# Altium schematic sheet Pocket_musical_instrument V18_2021-09-19.schdoc
size 990 x 389 mm
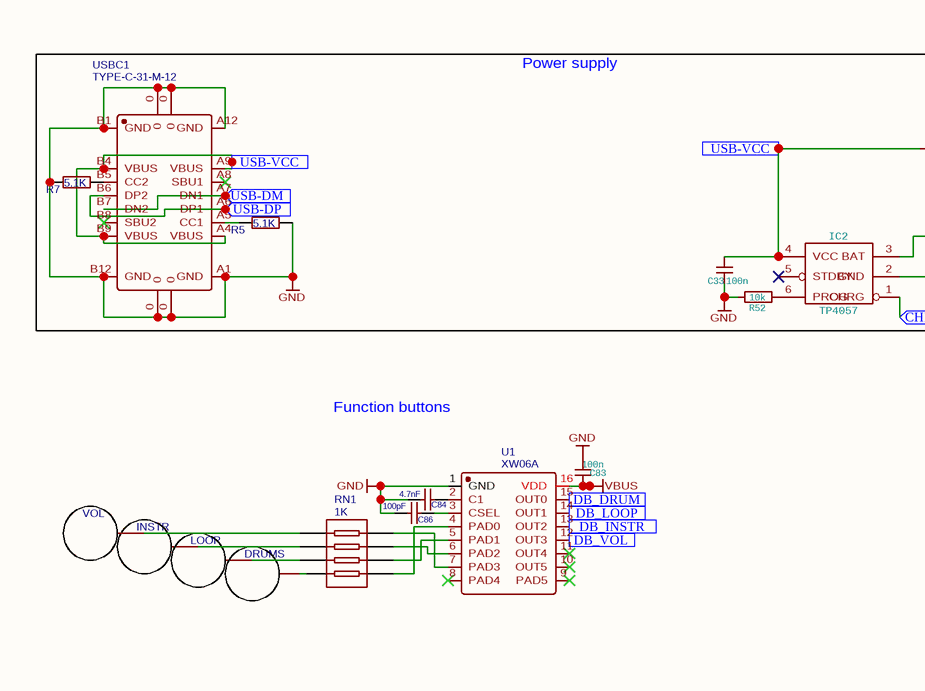
[diagram p0: Pocket_musical_instrument V18_2021-09-19.schdoc, top left]
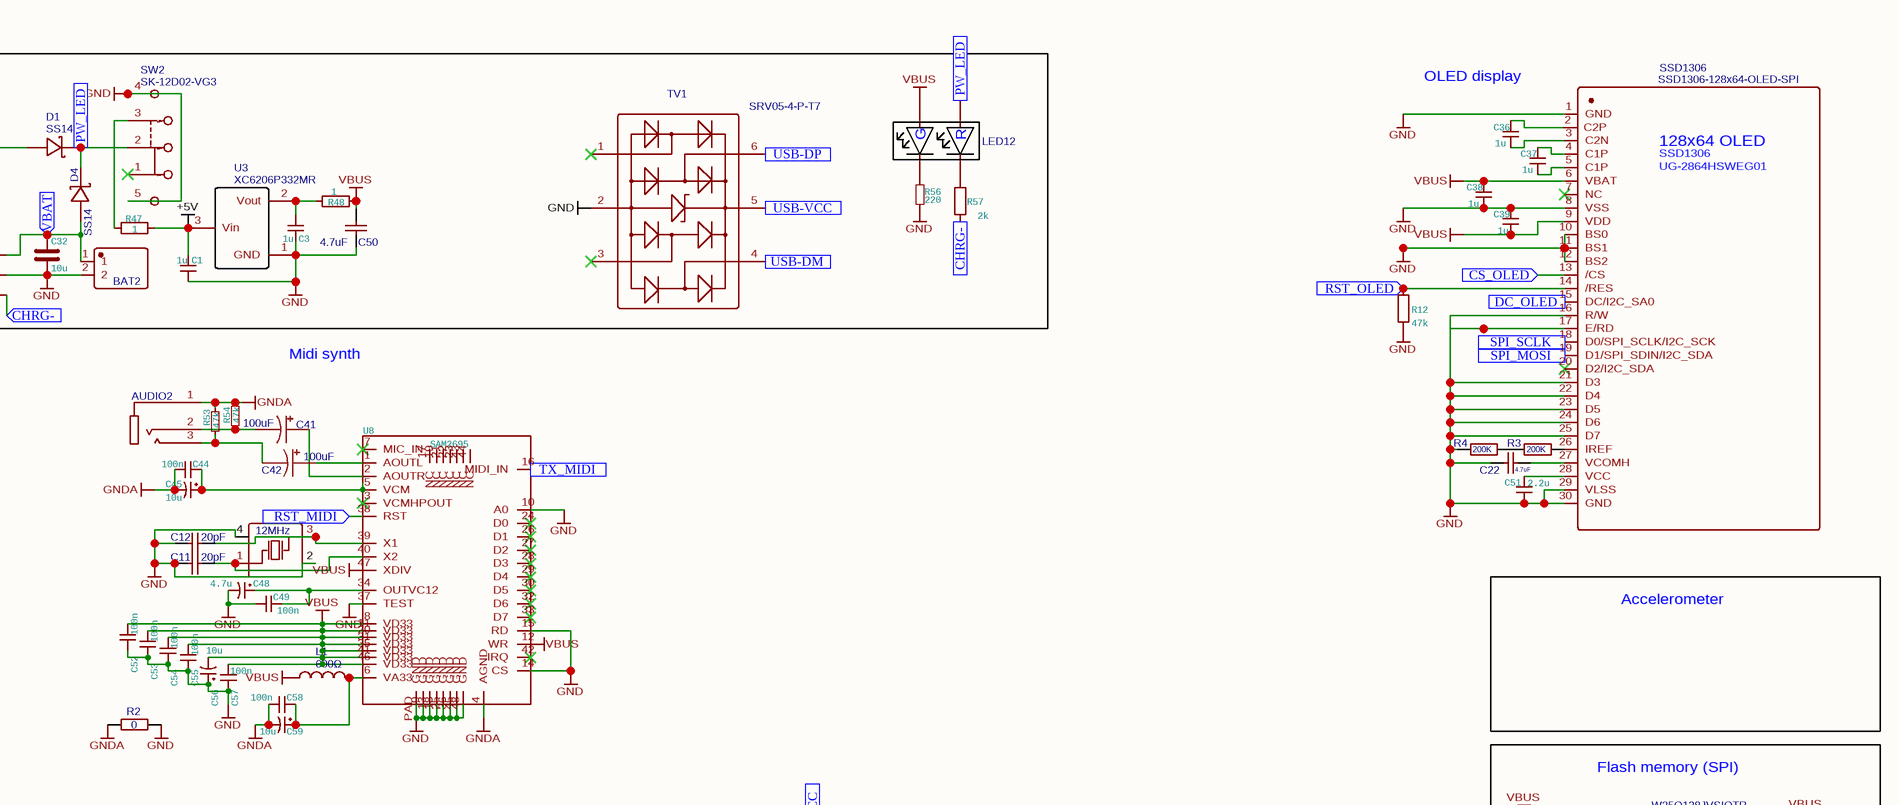
[diagram p1: Pocket_musical_instrument V18_2021-09-19.schdoc, top middle]
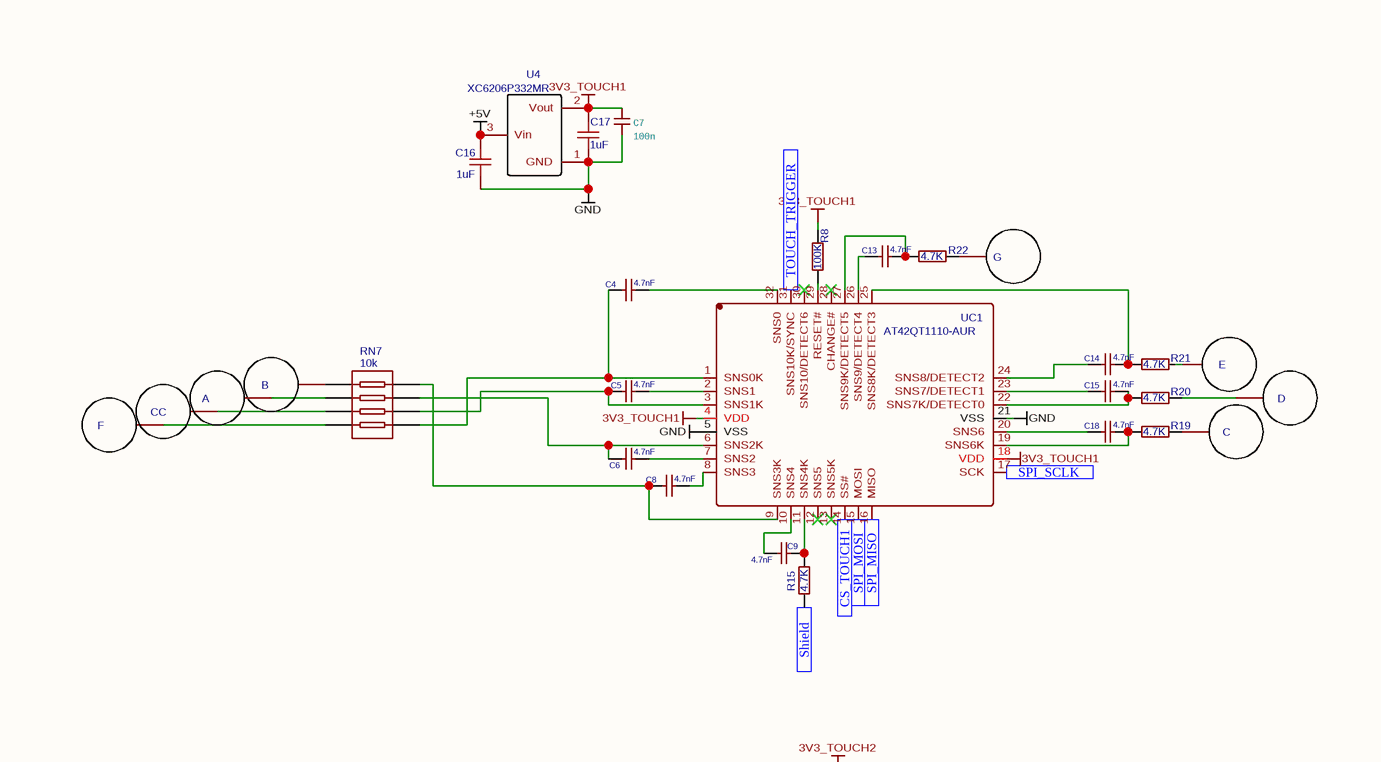
[diagram p2: Pocket_musical_instrument V18_2021-09-19.schdoc, top right]
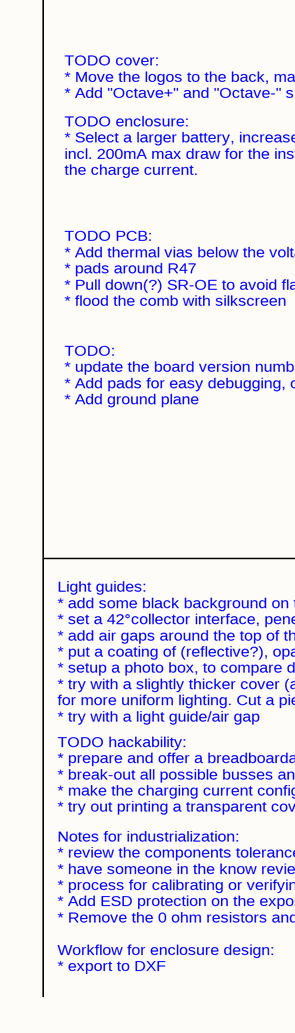
[diagram p3: Pocket_musical_instrument V18_2021-09-19.schdoc, bottom left]
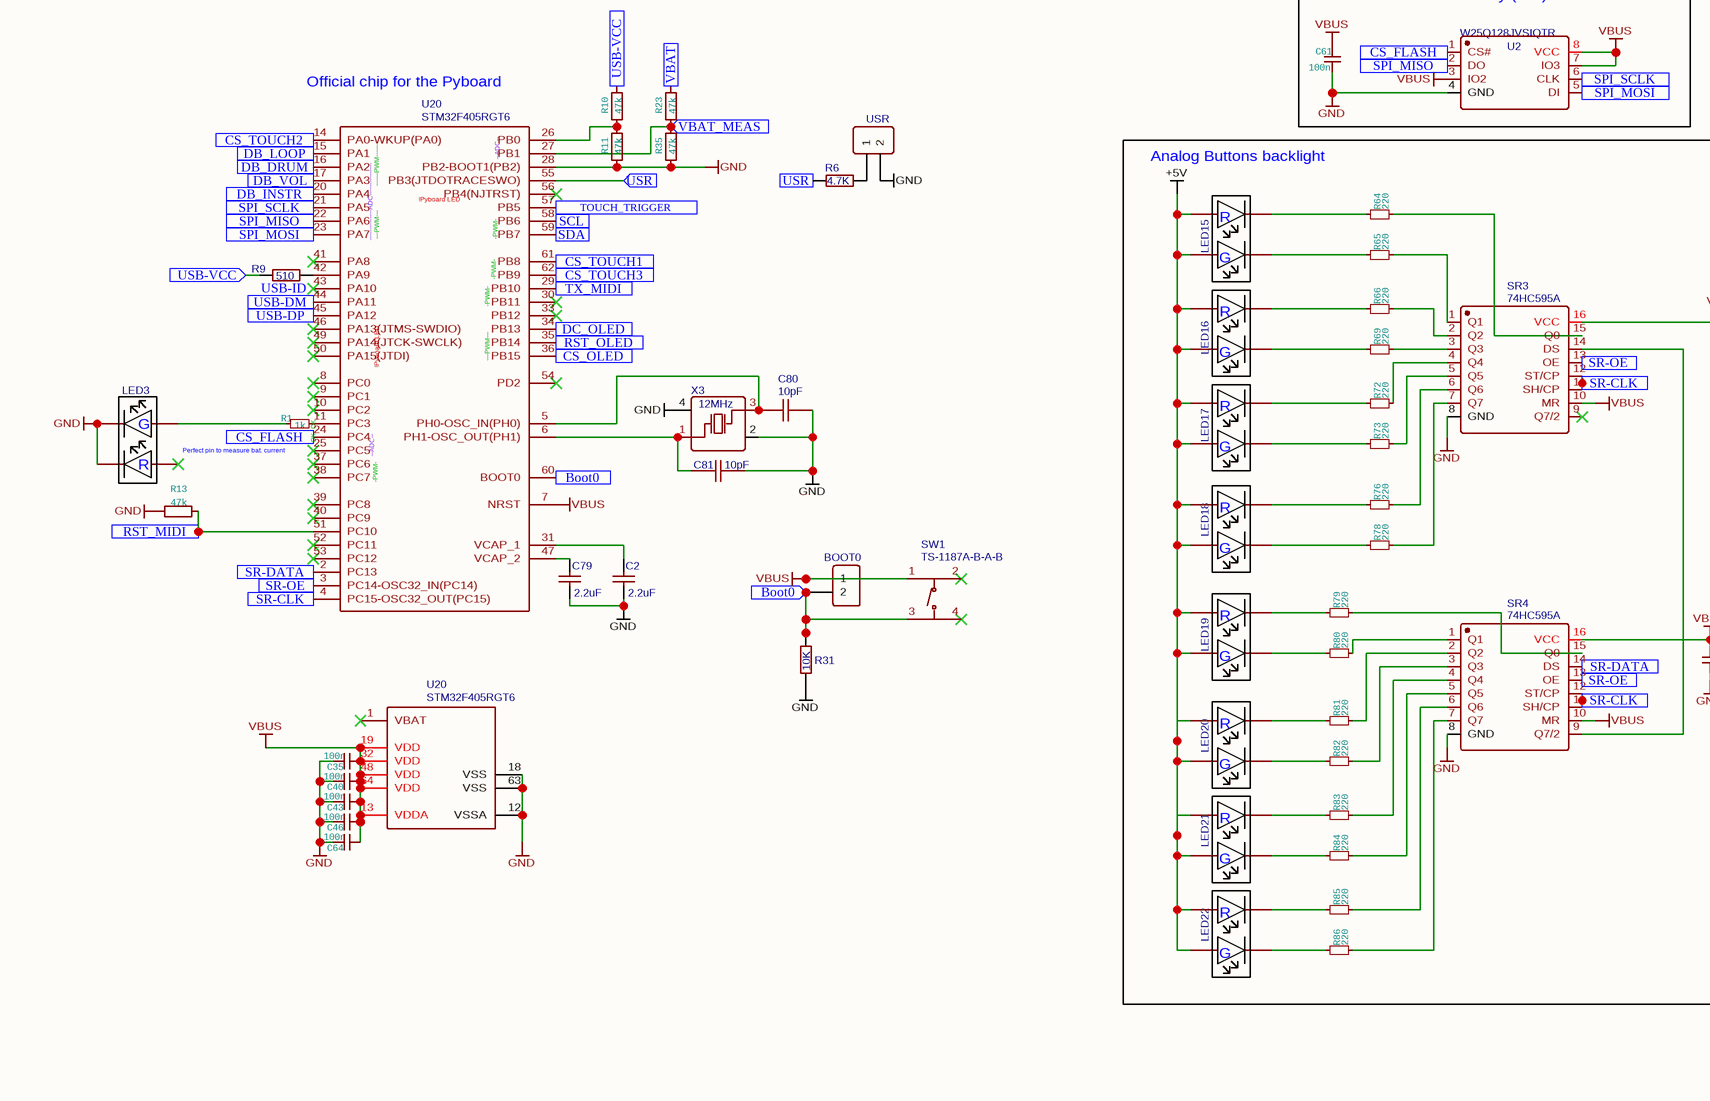
[diagram p4: Pocket_musical_instrument V18_2021-09-19.schdoc, bottom middle]
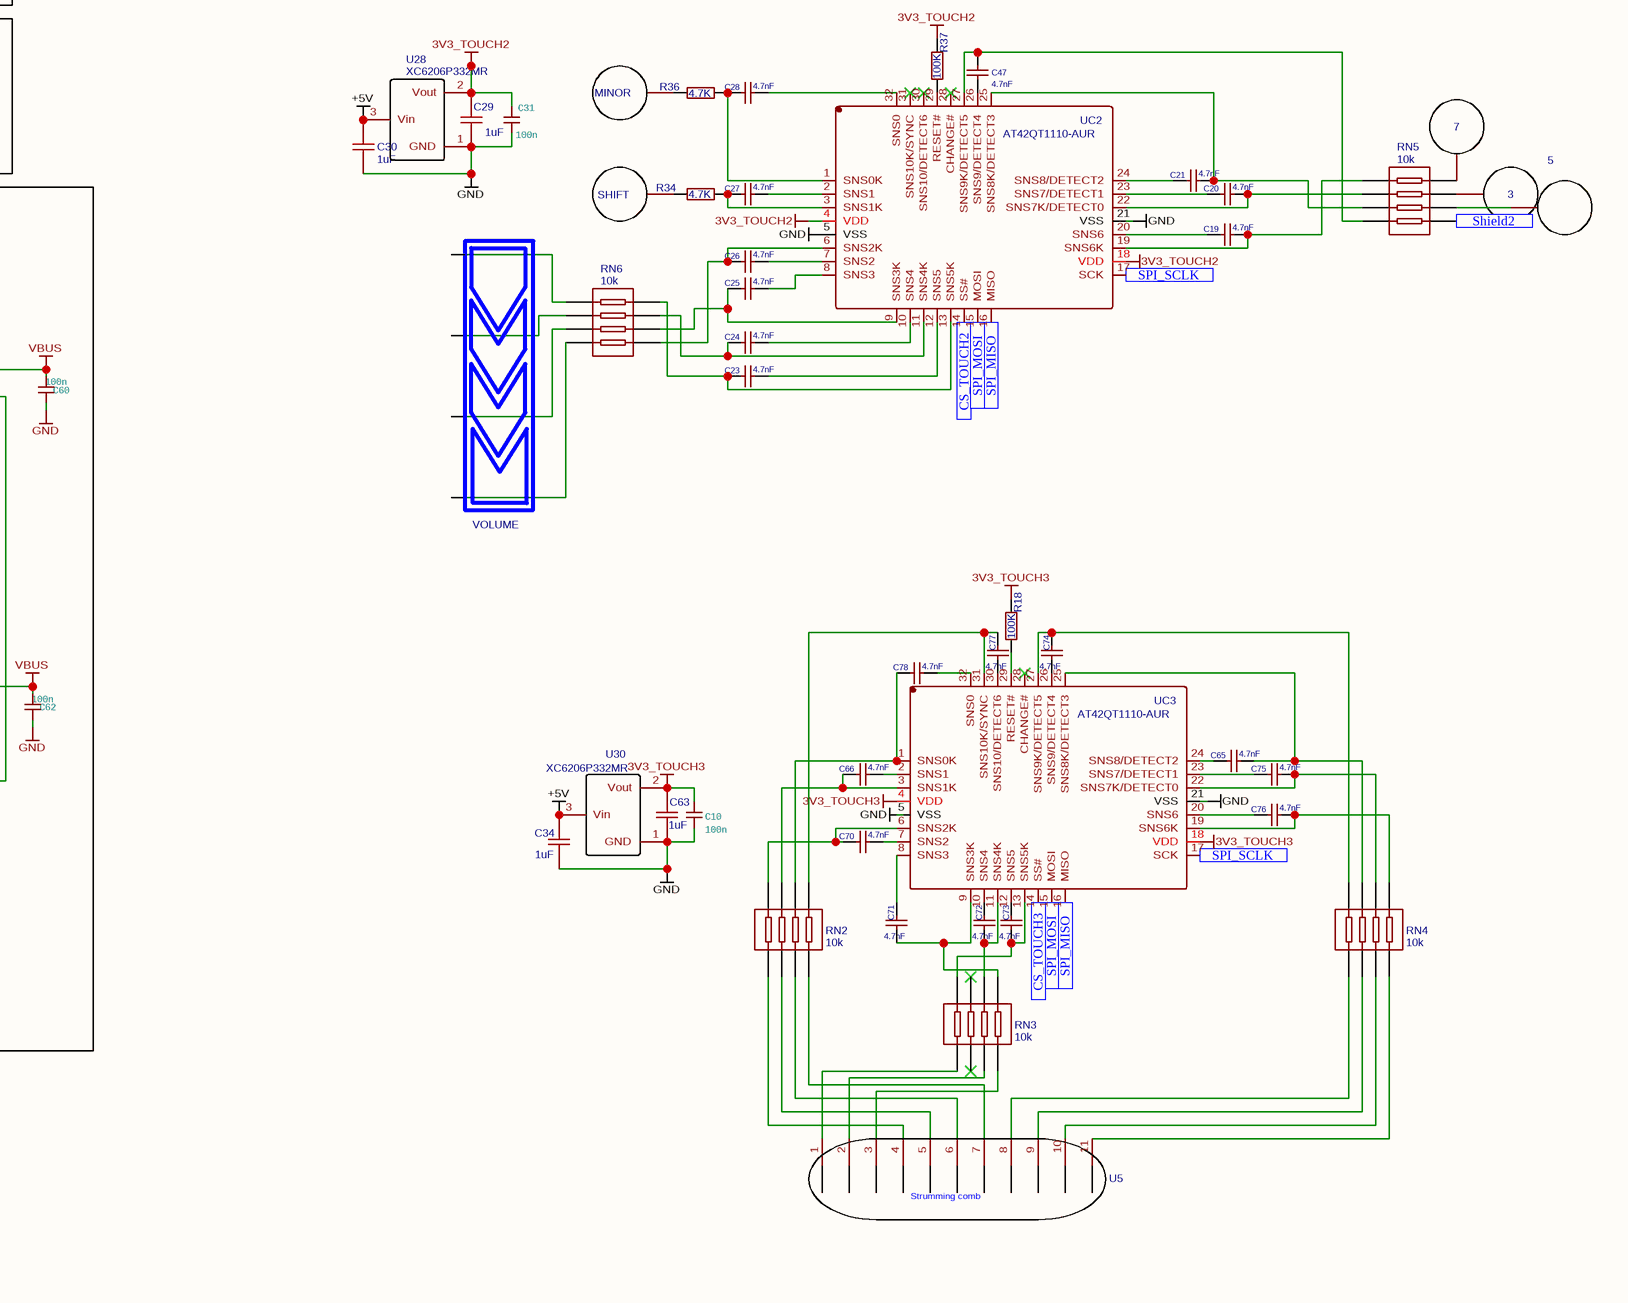
[diagram p5: Pocket_musical_instrument V18_2021-09-19.schdoc, bottom right]

## Parts
(Parts that share a designator on the sheet are numbered #1, #2 ... from top to bottom, then left to right.)
3  CAPACITIVE_PAD  [CAPACITIVE_PAD_ROUND]  (value not drawn)
5  CAPACITIVE_PAD  [CAPACITIVE_PAD_ROUND]  (value not drawn)
7  CAPACITIVE_PAD  [CAPACITIVE_PAD_ROUND]  (value not drawn)
A  CAPACITIVE_PAD  [PAD_11MM_CUT-OFF]  (value not drawn)
AUDIO2  PJ-313D_C319112  [PHONE-JACK-5P-6.0X12.5-H5.0]  (value not drawn)
B  CAPACITIVE_PAD  [PAD_11MM_CUT-OFF]  (value not drawn)
BAT2  A2001WR-S-2P  [A2001WR-S-2P]  (value not drawn)
C  CAPACITIVE_PAD  [PAD_11MM_CUT-OFF]  (value not drawn)
C1  1u  [0402]
C2  2.2uF  [C0603]
C3  1u  [0402]
C4  4.7nF  [C0402]
C5  4.7nF  [C0402]
C6  4.7nF  [C0402]
C7  100n  [0402]
C8  4.7nF  [C0402]
C9  4.7nF  [C0402]
C10  100n  [0402]
C11  20pF  [C0402]
C12  20pF  [C0402]
C13  4.7nF  [C0402]
C14  4.7nF  [C0402]
C15  4.7nF  [C0402]
C16  1uF  [C0402]
C17  1uF  [C0402]
C18  4.7nF  [C0402]
C19  4.7nF  [C0402]
C20  4.7nF  [C0402]
C21  4.7nF  [C0402]
C22  4.7uF  [C0402]
C23  4.7nF  [C0402]
C24  4.7nF  [C0402]
C25  4.7nF  [C0402]
C26  4.7nF  [C0402]
C27  4.7nF  [C0402]
C28  4.7nF  [C0402]
C29  1uF  [C0402]
C30  1uF  [C0402]
C31  100n  [0402]
C32  10u  [0402]
C33  100n  [0402]
C34  1uF  [C0402]
C35  100n  [0402]
C36  1u  [0402]
C37  1u  [0402]
C38  1u  [0402]
C39  1u  [0402]
C40  100n  [0402]
C41  100uF  [CAP_5X5.4]
C42  100uF  [CAP_5X5.4]
C43  100n  [0402]
C44  100n  [0402]
C45  10u  [0402]
C46  100n  [0402]
C47  4.7nF  [C0402]
C48  4.7u  [0402]
C49  100n  [0402]
C50  4.7uF  [C0402]
C51  2.2u  [0603]
C52  100n  [0402]
C53  100n  [0402]
C54  100n  [0402]
C55  100n  [0402]
C56  10u  [0402]
C57  100n  [0402]
C58  100n  [0402]
C59  10u  [0402]
C60  100n  [0402]
C61  100n  [0402]
C62  100n  [0402]
C63  1uF  [C0402]
C64  100n  [0402]
C65  4.7nF  [C0402]
C66  4.7nF  [C0402]
C70  4.7nF  [C0402]
C71  4.7nF  [C0402]
C72  4.7nF  [C0402]
C73  4.7nF  [C0402]
C74  4.7nF  [C0402]
C75  4.7nF  [C0402]
C76  4.7nF  [C0402]
C77  4.7nF  [C0402]
C78  4.7nF  [C0402]
C79  2.2uF  [C0603]
C80  10pF  [C0402]
C81  10pF  [C0402]
C83  100n  [0402]
C84  4.7nF  [C0402]
C86  100pF  [C0402]
CC  CAPACITIVE_PAD  [PAD_11MM_CUT-OFF]  (value not drawn)
D  CAPACITIVE_PAD  [PAD_11MM_CUT-OFF]  (value not drawn)
D1  SS14  [SMA_L4.3-W2.6-LS5.2-FD]
D4  SS14  [SMA_L4.3-W2.6-LS5.2-FD]
DRUMS  CAPACITIVE_PAD  [T1147-1_PIN]  (value not drawn)
E  CAPACITIVE_PAD  [PAD_11MM_CUT-OFF]  (value not drawn)
F  CAPACITIVE_PAD  [PAD_11MM_CUT-OFF]  (value not drawn)
G  CAPACITIVE_PAD  [PAD_11MM_CUT-OFF]  (value not drawn)
IC2  TP4057  [SOT-23-6]
INSTR  CAPACITIVE_PAD  [T1147-1_PIN]  (value not drawn)
L1  600Ω  [L0805]
LED3  SHIFT  [LED-SMD_4PIN-L3.2-W1.25-H1.1-TR-TEMPE]  (value not drawn)
LED12  PW/CHRG  [LED-SMD_4PIN-L3.2-W1.25-H1.1-TR-TEMPE]  (value not drawn)
LED15  Reverse bicolor LED  [LED-SMD_4PIN-L3.2-W1.25-H1.1-TR-TEMPE]  (value not drawn)
LED16  Reverse bicolor LED  [LED-SMD_4PIN-L3.2-W1.25-H1.1-TR-TEMPE]  (value not drawn)
LED17  Reverse bicolor LED  [LED-SMD_4PIN-L3.2-W1.25-H1.1-TR-TEMPE]  (value not drawn)
LED18  Reverse bicolor LED  [LED-SMD_4PIN-L3.2-W1.25-H1.1-TR-TEMPE]  (value not drawn)
LED19  Reverse bicolor LED  [LED-SMD_4PIN-L3.2-W1.25-H1.1-TR-TEMPE]  (value not drawn)
LED20  Reverse bicolor LED  [LED-SMD_4PIN-L3.2-W1.25-H1.1-TR-TEMPE]  (value not drawn)
LED21  Reverse bicolor LED  [LED-SMD_4PIN-L3.2-W1.25-H1.1-TR-TEMPE]  (value not drawn)
LED22  Reverse bicolor LED  [LED-SMD_4PIN-L3.2-W1.25-H1.1-TR-TEMPE]  (value not drawn)
LOOP  CAPACITIVE_PAD  [T1147-1_PIN]  (value not drawn)
MINOR  CAPACITIVE_PAD  [CAPACITIVE_PAD_OVAL_22_8]  (value not drawn)
P1  BOOT0  [JUMPER]
P3  USR  [JUMPER]
R1  1k  [0402]
R2  0  [R0402]
R3  200K  [R0402]
R4  200K  [R0402]
R5  5.1K  [R0402]
R6  4.7K  [R0402]
R7  5.1K  [R0402]
R8  100K  [R0402]
R9  510  [R0402]
R10  47k  [0402]
R11  47k  [0402]
R12  47k  [0402]
R13  47k  [0402]
R15  4.7K  [R0402]
R18  100K  [R0402]
R19  4.7K  [R0402]
R20  4.7K  [R0402]
R21  4.7K  [R0402]
R22  4.7K  [R0402]
R23  47k  [0402]
R31  10K  [R0402]
R34  4.7K  [R0402]
R35  47k  [0402]
R36  4.7K  [R0402]
R37  100K  [R0402]
R47  1  [0402]
R48  1  [0402]
R52  10k  [0402]
R53  47k  [0402]
R54  47k  [0402]
R56  220  [0402]
R57  2k  [0402]
R64  220  [0402]
R65  220  [0402]
R66  220  [0402]
R69  220  [0402]
R72  220  [0402]
R73  220  [0402]
R76  220  [0402]
R78  220  [0402]
R79  220  [0402]
R80  220  [0402]
R81  220  [0402]
R82  220  [0402]
R83  220  [0402]
R84  220  [0402]
R85  220  [0402]
R86  220  [0402]
RN1  1K  [RES-ARRAY-SMD_0402-8P-L2.0-W1.0-BL]
RN2  10k  [RES-ARRAY-SMD_0402-8P-L2.0-W1.0-BL]
RN3  10k  [RES-ARRAY-SMD_0402-8P-L2.0-W1.0-BL]
RN4  10k  [RES-ARRAY-SMD_0402-8P-L2.0-W1.0-BL]
RN5  10k  [RES-ARRAY-SMD_0402-8P-L2.0-W1.0-BL]
RN6  10k  [RES-ARRAY-SMD_0402-8P-L2.0-W1.0-BL]
RN7  10k  [RES-ARRAY-SMD_0402-8P-L2.0-W1.0-BL]
SHIFT  CAPACITIVE_PAD  [CAPACITIVE_PAD_ROUND]  (value not drawn)
SR3  74HC595A  [SOIC-16_150MIL]
SR4  74HC595A  [SOIC-16_150MIL]
SSD1306  SSD1306-128x64-OLED-SPI  [SSD1306-30PIN-POT REVERSED]
SW1  TS-1187A-B-A-B  [SW-SMD_4P-L5.1-W5.1-P3.70-LS6.5-2]
SW2  SK-12D02-VG3  [SW-TH_SK-12D02VG3]
TV1  SRV05-4-P-T7  [SOT-23-6_L2.9-W1.6-P0.95-LS2.8-BR]
U1  XW06A  [SOP-16_L10.0-W3.9-P1.27-LS6.0-BL]
U2  W25Q128JVSIQTR  [SOIC-8_L5.3-W5.3-P1.27-LS8.0-BL]
U3  XC6206P332MR  [SOT-23-3_L2.9-W1.6-P1.90-LS2.8-BR]
U4  XC6206P332MR  [SOT-23-3_L2.9-W1.6-P1.90-LS2.8-BR]
U5  Strumming_comb_11  [STRUMMING_COMB_11]  (value not drawn)
U8  SAM2695  [QFN48G-0.4-6X6MM]
U20#1  STM32F405RGT6  [LQFP-64_L10.0-W10.0-P0.50-LS12.0-TL]
U20#2  STM32F405RGT6  [LQFP-64_L10.0-W10.0-P0.50-LS12.0-TL]
U28  XC6206P332MR  [SOT-23-3_L2.9-W1.6-P1.90-LS2.8-BR]
U30  XC6206P332MR  [SOT-23-3_L2.9-W1.6-P1.90-LS2.8-BR]
UC1  AT42QT1110-AUR  [TQFP-32_L7.0-W7.0-P0.80-LS9.0-BL]
UC2  AT42QT1110-AUR  [TQFP-32_L7.0-W7.0-P0.80-LS9.0-BL]
UC3  AT42QT1110-AUR  [TQFP-32_L7.0-W7.0-P0.80-LS9.0-BL]
USBC1  TYPE-C-31-M-12  [USB-C_SMD-TYPE-C-31-M-12]
VOL  CAPACITIVE_PAD  [T1147-1_PIN]  (value not drawn)
VOLUME  Slide Key 4 pads  [SLIDER_4]  (value not drawn)
X1  12MHz  [OSC-SMD_4P-L3.2-W2.5-BL]
X3  12MHz  [OSC-SMD_4P-L3.2-W2.5-BL]

## Blocks framed on the sheet
Power supply: BAT2 C1 C3 C32 C33 C50 D1 D4 IC2 LED12 R5 R7 R47 R48 R52 R56 R57 SW2 TV1 U3 USBC1
Flash memory (SPI): C61 U2
Analog Buttons backlight: C60 C62 LED15-LED22 R64-R66 R69 R72 R73 R76 R78-R86 SR3 SR4

## Ports
Boot0 (in), CHRG- (in), CS_FLASH (in), CS_OLED (in), CS_TOUCH1 (in), CS_TOUCH2 (in), CS_TOUCH3 (in), DB_DRUM (in), DB_INSTR (in), DB_LOOP (in), DB_VOL (in), DC_OLED (in), PW_LED (in), RST_MIDI (in), RST_OLED (in), SCL (in), SDA (in), Shield2 (in), Shield (in), SPI_MISO (in), SPI_MOSI (in), SPI_SCLK (in), SR-CLK (in), SR-DATA (in), SR-OE (in), TOUCH_TRIGGER (in), TX_MIDI (in), USB-DM (in), USB-DP (in), USB-VCC (in), USR (in), VBAT (in), VBAT_MEAS (in)

## Nets
3V3_TOUCH1: C7.1 C17.2 R8.2 U4.2(Vout) UC1.4(VDD) UC1.18(VDD)
3V3_TOUCH2: C29.2 C31.2 R37.2 U28.2(Vout) UC2.4(VDD) UC2.18(VDD)
3V3_TOUCH3: C10.1 C63.2 R18.2 U30.2(Vout) UC3.4(VDD) UC3.18(VDD)
+5V: C1.2 C16.2 C30.2 C34.2 LED15.1 LED15.3 LED16.1 LED16.3 LED17.1 LED17.3 LED18.1 LED18.3 LED19.1 LED19.3 LED20.1 LED20.3 LED21.1 LED21.3 LED22.1 LED22.3 R47.2 U3.3(Vin) U4.3(Vin) U28.3(Vin) U30.3(Vin)
GND: BAT2.2 C1.1 C2.2 C3.1 C7.2 C10.2 C11.1 C12.1 C16.1 C17.1 C22.1 C29.1 C30.1 C31.1 C32.2 C33.2 C34.1 C35.1 C38.2 C39.1 C40.1 C43.1 C46.1 C48.2 C49.2 C50.1 C51.2 C52.1 C53.1 C54.1 C55.1 C56.1 C57.1 C60.2 C61.1 C62.2 C63.1 C64.1 C79.1 C80.2 C81.1 C83.1 C84.1 C86.1 IC2.2(GND) LED3.2 LED3.4 P3.2 R2.1 R4.1 R5.2 R7.1 R11.1 R12.2 R13.1 R31.2 R35.1 R52.2 R56.2 SR3.8(GND) SR4.8(GND) SSD1306.1(GND) SSD1306.8(VSS) SSD1306.10(BS0) SSD1306.11(BS1) SSD1306.12(BS2) SSD1306.16(R/W) SSD1306.17(E/RD) SSD1306.21(D3) SSD1306.22(D4) SSD1306.23(D5) SSD1306.24(D6) SSD1306.25(D7) SSD1306.29(VLSS) SSD1306.30(GND) SW2.4 SW2.5 TV1.2 U1.1(GND) U2.4(GND) U3.1(GND) U4.1(GND) U8.9(GND) U8.10(A0) U8.13(GND) U8.14(CS) U8.15(RD) U8.18(GND) U8.25(GND) U8.36(GND) U8.37(TEST) U8.45(GND) U8.48(GND) U8.PAD(GND) U20#1.28(PB2-BOOT1(PB2)) U20#2.12(VSSA) U20#2.18(VSS) U20#2.63(VSS) U28.1(GND) U30.1(GND) UC1.5(VSS) UC1.21(VSS) UC2.5(VSS) UC2.21(VSS) UC3.5(VSS) UC3.21(VSS) USBC1.0 USBC1.A1(GND) USBC1.A12(GND) USBC1.B1(GND) USBC1.B12(GND) X1.2(GND) X1.4(GND) X3.2(GND) X3.4(GND)
GNDA: AUDIO2.1 C44.2 C45.2 C58.2 C59.2 R2.2 R53.1 R54.1 U8.4(AGND)
VBUS: C35.2 C38.1 C39.2 C40.2 C43.2 C46.2 C50.2 C52.2 C53.2 C54.2 C55.2 C56.2 C57.2 C60.1 C61.2 C62.1 C64.2 C83.2 L1.1 LED12.1 P1.1 R48.2 SR3.10(MR) SR3.16(VCC) SR4.10(MR) SR4.16(VCC) SSD1306.6(VBAT) SSD1306.9(VDD) SW1.1(A) U1.16(VDD) U2.3(IO2) U2.7(IO3) U2.8(VCC) U8.8(VD33) U8.11(VD33) U8.12(WR) U8.20(VD33) U8.31(VD33) U8.35(VD33) U8.41(VD33) U8.46(VD33) U8.47(XDIV) U20#1.7(NRST) U20#2.13(VDDA) U20#2.19(VDD) U20#2.32(VDD) U20#2.48(VDD) U20#2.64(VDD)
Boot0: P1.2 R31.1 SW1.3(C) U20#1.60(BOOT0) ; port Boot0
CHRG-: IC2.1(CHRG) R57.2 ; port CHRG-
CS_FLASH: U2.1(CS#) U20#1.24(PC4) ; port CS_FLASH
CS_OLED: SSD1306.13(/CS) U20#1.36(PB15) ; port CS_OLED
CS_TOUCH1: U20#1.61(PB8) UC1.14(SS#) ; port CS_TOUCH1
CS_TOUCH2: U20#1.14(PA0-WKUP(PA0)) UC2.14(SS#) ; port CS_TOUCH2
CS_TOUCH3: U20#1.62(PB9) UC3.14(SS#) ; port CS_TOUCH3
DB_DRUM: U1.15(OUT0) U20#1.16(PA2) ; port DB_DRUM
DB_INSTR: U1.13(OUT2) U20#1.20(PA4) ; port DB_INSTR
DB_LOOP: U1.14(OUT1) U20#1.15(PA1) ; port DB_LOOP
DB_VOL: U1.12(OUT3) U20#1.17(PA3) ; port DB_VOL
DC_OLED: SSD1306.15(DC/I2C_SA0) U20#1.34(PB13) ; port DC_OLED
PW_LED: D1.2(K) D4.2(K) LED12.3 R47.1 SW2.2 SW2.3 ; port PW_LED
RST_MIDI: R13.2 U8.38(RST) U20#1.51(PC10) ; port RST_MIDI
RST_OLED: R12.1 SSD1306.14(/RES) U20#1.35(PB14) ; port RST_OLED
SCL: U20#1.58(PB6) ; port SCL
SDA: U20#1.59(PB7) ; port SDA
Shield: R15.2 ; port Shield
Shield2: RN5.5 ; port Shield2
SPI_MISO: U2.2(DO) U20#1.22(PA6) UC1.16(MISO) UC2.16(MISO) UC3.16(MISO) ; port SPI_MISO
SPI_MOSI: SSD1306.19(D1/SPI_SDIN/I2C_SDA) U2.5(DI) U20#1.23(PA7) UC1.15(MOSI) UC2.15(MOSI) UC3.15(MOSI) ; port SPI_MOSI
SPI_SCLK: SSD1306.18(D0/SPI_SCLK/I2C_SCK) U2.6(CLK) U20#1.21(PA5) UC1.17(SCK) UC2.17(SCK) UC3.17(SCK) ; port SPI_SCLK
SR-CLK: SR3.11(SH/CP) SR3.12(ST/CP) SR4.11(SH/CP) SR4.12(ST/CP) U20#1.4(PC15-OSC32_OUT(PC15)) ; port SR-CLK
SR-DATA: SR4.14(DS) U20#1.2(PC13) ; port SR-DATA
SR-OE: SR3.13(OE) SR4.13(OE) U20#1.3(PC14-OSC32_IN(PC14)) ; port SR-OE
TOUCH_TRIGGER: U20#1.57(PB5) UC1.31(SNS10K/SYNC) ; port TOUCH_TRIGGER
TX_MIDI: U8.16(MIDI_IN) U20#1.29(PB10) ; port TX_MIDI
USB-DM: TV1.4 U20#1.44(PA11) USBC1.A7(DN1) USBC1.B7(DN2) ; port USB-DM
USB-DP: TV1.6 U20#1.45(PA12) USBC1.A6(DP1) USBC1.B6(DP2) ; port USB-DP
USB-VCC: C33.1 D1.1(A) IC2.4(VCC) R9.1 R10.1 TV1.5 USBC1.A4(VBUS) USBC1.A9(VBUS) USBC1.B4(VBUS) USBC1.B9(VBUS) ; port USB-VCC
USR: R6.1 U20#1.55(PB3(JTDOTRACESWO)) ; port USR
VBAT: BAT2.1 C32.1 D4.1(A) IC2.3(BAT) R23.1 ; port VBAT
VBAT_MEAS: R23.2 R35.2 U20#1.27(PB1) ; port VBAT_MEAS
Net3_1: 3.1 RN5.7
Net5_1: 5.1 RN5.6
Net7_1: 7.1 RN5.8
NetA_1: A.1 RN7.2
NetAUDIO2_2: AUDIO2.2 C41.2 R54.2
NetAUDIO2_3: AUDIO2.3 C42.2 R53.2
NetB_1: B.1 RN7.1
NetC2_1: C2.1 U20#1.31(VCAP_1)
NetC3_2: C3.2 R48.1 U3.2(Vout)
NetC4_1: C4.1 UC1.32(SNS0)
NetC4_2: C4.2 RN7.5 UC1.1(SNS0K)
NetC5_1: C5.1 UC1.2(SNS1)
NetC5_2: C5.2 RN7.6 UC1.3(SNS1K)
NetC6_1: C6.1 UC1.7(SNS2)
NetC6_2: C6.2 RN7.7 UC1.6(SNS2K)
NetC8_1: C8.1 UC1.8(SNS3)
NetC8_2: C8.2 RN7.8 UC1.9(SNS3K)
NetC9_1: C9.1 R15.1 UC1.11(SNS4K)
NetC9_2: C9.2 UC1.10(SNS4)
NetC11_2: C11.2 U8.40(X2) X1.1(OSC1)
NetC12_2: C12.2 U8.39(X1) X1.3(OSC2)
NetC13_1: C13.1 R22.2 UC1.27(SNS9K/DETECT5)
NetC13_2: C13.2 UC1.26(SNS9/DETECT4)
NetC14_1: C14.1 R21.2 UC1.25(SNS8K/DETECT3)
NetC14_2: C14.2 UC1.24(SNS8/DETECT2)
NetC15_1: C15.1 R20.2 UC1.22(SNS7K/DETECT0)
NetC15_2: C15.2 UC1.23(SNS7/DETECT1)
NetC18_1: C18.1 R19.2 UC1.19(SNS6K)
NetC18_2: C18.2 UC1.20(SNS6)
NetC19_1: C19.1 RN5.1 UC2.19(SNS6K)
NetC19_2: C19.2 UC2.20(SNS6)
NetC20_1: C20.1 RN5.2 UC2.22(SNS7K/DETECT0)
NetC20_2: C20.2 UC2.23(SNS7/DETECT1)
NetC21_1: C21.1 RN5.3 UC2.25(SNS8K/DETECT3)
NetC21_2: C21.2 UC2.24(SNS8/DETECT2)
NetC22_2: C22.2 SSD1306.27(VCOMH)
NetC23_1: C23.1 UC2.12(SNS5)
NetC23_2: C23.2 RN6.8 UC2.13(SNS5K)
NetC24_1: C24.1 UC2.10(SNS4)
NetC24_2: C24.2 RN6.7 UC2.11(SNS4K)
NetC25_1: C25.1 UC2.8(SNS3)
NetC25_2: C25.2 RN6.6 UC2.9(SNS3K)
NetC26_1: C26.1 UC2.7(SNS2)
NetC26_2: C26.2 RN6.5 UC2.6(SNS2K)
NetC27_1: C27.1 UC2.2(SNS1)
NetC27_2: C27.2 R34.2 UC2.3(SNS1K)
NetC28_1: C28.1 UC2.32(SNS0)
NetC28_2: C28.2 R36.2 UC2.1(SNS0K)
NetC36_1: C36.1 SSD1306.2(C2P)
NetC36_2: C36.2 SSD1306.3(C2N)
NetC37_1: C37.1 SSD1306.4(C1P)
NetC37_2: C37.2 SSD1306.5(C1P)
NetC41_1: C41.1 U8.2(AOUTR)
NetC42_1: C42.1 U8.1(AOUTL)
NetC44_1: C44.1 C45.1 U8.5(VCM)
NetC47_1: C47.1 RN5.4 UC2.27(SNS9K/DETECT5)
NetC47_2: C47.2 UC2.26(SNS9/DETECT4)
NetC48_1: C48.1 C49.1 U8.34(OUTVC12)
NetC51_1: C51.1 SSD1306.28(VCC)
NetC58_1: C58.1 C59.1 L1.2 U8.6(VA33)
NetC65_1: C65.1 RN4.7 UC3.25(SNS8K/DETECT3)
NetC65_2: C65.2 UC3.24(SNS8/DETECT2)
NetC66_1: C66.1 UC3.2(SNS1)
NetC66_2: C66.2 RN2.7 UC3.3(SNS1K)
NetC70_1: C70.1 UC3.7(SNS2)
NetC70_2: C70.2 RN2.8 UC3.6(SNS2K)
NetC71_1: C71.1 RN3.5 UC3.9(SNS3K)
NetC71_2: C71.2 UC3.8(SNS3)
NetC72_1: C72.1 RN3.6 UC3.11(SNS4K)
NetC72_2: C72.2 UC3.10(SNS4)
NetC73_1: C73.1 RN3.8 UC3.13(SNS5K)
NetC73_2: C73.2 UC3.12(SNS5)
NetC74_1: C74.1 UC3.26(SNS9/DETECT4)
NetC74_2: C74.2 RN4.8 UC3.27(SNS9K/DETECT5)
NetC75_1: C75.1 RN4.6 UC3.22(SNS7K/DETECT0)
NetC75_2: C75.2 UC3.23(SNS7/DETECT1)
NetC76_1: C76.1 RN4.5 UC3.19(SNS6K)
NetC76_2: C76.2 UC3.20(SNS6)
NetC77_1: C77.1 UC3.30(SNS10/DETECT6)
NetC77_2: C77.2 RN2.5 UC3.31(SNS10K/SYNC)
NetC78_1: C78.1 UC3.32(SNS0)
NetC78_2: C78.2 RN2.6 UC3.1(SNS0K)
NetC79_2: C79.2 U20#1.47(VCAP_2)
NetC80_1: C80.1 U20#1.5(PH0-OSC_IN(PH0)) X3.3(OSC2)
NetC81_2: C81.2 U20#1.6(PH1-OSC_OUT(PH1)) X3.1(OSC1)
NetC84_2: C84.2 U1.2(C1)
NetC86_2: C86.2 U1.3(CSEL)
NetC_1: C.1 R19.1
NetCC_1: CC.1 RN7.3
NetD_1: D.1 R20.1
NetDRUMS_1: DRUMS.1 RN1.4
NetE_1: E.1 R21.1
NetF_1: F.1 RN7.4
NetG_1: G.1 R22.1
NetIC2_6: IC2.6(PROG) R52.1
NetINSTR_1: INSTR.1 RN1.2
NetLED3_1: LED3.1 R1.2
NetLED12_2: LED12.2 R56.1
NetLED12_4: LED12.4 R57.1
NetLED15_2: LED15.2 R65.1
NetLED15_4: LED15.4 R64.1
NetLED16_2: LED16.2 R69.1
NetLED16_4: LED16.4 R66.1
NetLED17_2: LED17.2 R73.1
NetLED17_4: LED17.4 R72.1
NetLED18_2: LED18.2 R78.1
NetLED18_4: LED18.4 R76.1
NetLED19_2: LED19.2 R80.1
NetLED19_4: LED19.4 R79.1
NetLED20_2: LED20.2 R82.1
NetLED20_4: LED20.4 R81.1
NetLED21_2: LED21.2 R84.1
NetLED21_4: LED21.4 R83.1
NetLED22_2: LED22.2 R86.1
NetLED22_4: LED22.4 R85.1
NetLOOP_1: LOOP.1 RN1.3
NetMINOR_1: MINOR.1 R36.1
NetP3_1: P3.1 R6.2
NetR1_1: R1.1 U20#1.11(PC3)
NetR3_1: R3.1 R4.2
NetR3_2: R3.2 SSD1306.26(IREF)
NetR5_1: R5.1 USBC1.A5(CC1)
NetR7_2: R7.2 USBC1.B5(CC2)
NetR8_1: R8.1 UC1.29(RESET#)
NetR9_2: R9.2 U20#1.42(PA9)
NetR10_2: R10.2 R11.2 U20#1.26(PB0)
NetR18_1: R18.1 UC3.29(RESET#)
NetR34_1: R34.1 SHIFT.1
NetR37_1: R37.1 UC2.29(RESET#)
NetR64_2: R64.2 SR3.15(Q0)
NetR65_2: R65.2 SR3.1(Q1)
NetR66_2: R66.2 SR3.2(Q2)
NetR69_2: R69.2 SR3.3(Q3)
NetR72_2: R72.2 SR3.4(Q4)
NetR73_2: R73.2 SR3.5(Q5)
NetR76_2: R76.2 SR3.6(Q6)
NetR78_2: R78.2 SR3.7(Q7)
NetR79_2: R79.2 SR4.15(Q0)
NetR80_2: R80.2 SR4.1(Q1)
NetR81_2: R81.2 SR4.2(Q2)
NetR82_2: R82.2 SR4.3(Q3)
NetR83_2: R83.2 SR4.4(Q4)
NetR84_2: R84.2 SR4.5(Q5)
NetR85_2: R85.2 SR4.6(Q6)
NetR86_2: R86.2 SR4.7(Q7)
NetRN1_1: RN1.1 VOL.1
NetRN1_5: RN1.5 U1.4(PAD0)
NetRN1_6: RN1.6 U1.5(PAD1)
NetRN1_7: RN1.7 U1.6(PAD2)
NetRN1_8: RN1.8 U1.7(PAD3)
NetRN2_1: RN2.1 U5.4
NetRN2_2: RN2.2 U5.5
NetRN2_3: RN2.3 U5.6
NetRN2_4: RN2.4 U5.7
NetRN3_1: RN3.1 U5.1
NetRN3_3: RN3.3 U5.2
NetRN3_4: RN3.4 U5.3
NetRN4_1: RN4.1 U5.8
NetRN4_2: RN4.2 U5.9
NetRN4_3: RN4.3 U5.10
NetRN4_4: RN4.4 U5.11
NetRN6_1: RN6.1 VOLUME.4
NetRN6_2: RN6.2 VOLUME.3
NetRN6_3: RN6.3 VOLUME.2
NetRN6_4: RN6.4 VOLUME.1
NetSR3_14: SR3.14(DS) SR4.9(Q7/2)

Not connected (* = marked no-connect by the designer): IC2 5(STDBY)*; LED3 3*; RN3 2* 7*; SR3 9(Q7/2)*; SSD1306 7(NC)* 20(D2/I2C_SDA)*; SW1 2(B)* 4(D)*; SW2 1*; TV1 1* 3*; U1 8(PAD4)* 9(PAD5)* 10(OUT5)* 11(OUT4)*; U8 3(VCMHPOUT)* 7(MIC_IN)* 17(NC) 19(NC) 21(NC) 22(NC) 23(NC) 24(D0)* 26(D1)* 27(D2)* 28(D3)* 29(D4)* 30(D5)* 32(D6)* 33(D7)* 42(IRQ)* 43(NC) 44(NC); U20#1 8(PC0)* 9(PC1)* 10(PC2)* 25(PC5)* 30(PB11)* 33(PB12)* 37(PC6)* 38(PC7)* 39(PC8)* 40(PC9)* 41(PA8)* 43(PA10)* 46(PA13(JTMS-SWDIO))* 49(PA14(JTCK-SWCLK))* 50(PA15(JTDI))* 52(PC11)* 53(PC12)* 54(PD2)* 56(PB4(NJTRST))*; U20#2 1(VBAT)*; UC1 12(SNS5)* 13(SNS5K)* 28(CHANGE#)* 30(SNS10/DETECT6)*; UC2 28(CHANGE#)* 30(SNS10/DETECT6)* 31(SNS10K/SYNC)*; UC3 28(CHANGE#)*; USBC1 A8(SBU1)* B8(SBU2)*

## Notes on the sheet
- OLED display
- Midi synth
- Function buttons
- Accelerometer
- (near U20#1) Official chip for the Pyboard
- (near U20#1) --ADC--
- (near R11) 47k
- (near U20#1) ------PWM------
- (near U20#1) !Pyboard LED
- TODO cover:
  * Move the logos to the back, make them larger
  * Add "Octave+" and "Octave-" signs to the 3rd/5th/7h keys
- (near U20#1) --------------ADC---------------
- (near U20#1) ---PWM---
- (near U20#1) -PWM-
- TODO enclosure:
  * Select a larger battery, increase the charge current (up to 500mA total,
  incl. 200mA max draw for the instrument), identify the resistor driving
  the charge current.
- (near R9) USB-ID
- (near R1) OK
- TODO PCB:
  * Add thermal vias below the voltage regulators and LED drivers
  * pads around R47
  * Pull down(?) SR-OE to avoid flashing LEDs
  * flood the comb with silkscreen
- Perfect pin to measure bat. current
- OK
- TODO:
  * update the board version number before producing
  * Add pads for easy debugging, on all busses, power, and I/O pins
  * Add ground plane
- Light guides:
  * add some black background on the cover plate around the keys, to make the border very sharp
  * set a 42°collector interface, penetrating inside the PCB
  * add air gaps around the top of the keys to block light leakage
  * put a coating of (reflective?), opaque paint on the inside of the case
  * setup a photo box, to compare different solutions
  * try with a slightly thicker cover (add a sheet of plastic of 0.5 or 1mm thickness between the PCB and cover)
  for more uniform lighting. Cut a piece of PCB to adjust the LED hole position for better light distribution.
  * try with a light guide/air gap
- TODO hackability:
  * prepare and offer a breadboardable version, with all IOs broken out but no screen and touch sensors
  * break-out all possible busses and I/O pins
  * make the charging current configurable with a through-hole resistor, and document it on the silkscreen
  * try out printing a transparent cover.
- Notes for industrialization:
  * review the components tolerances
  * have someone in the know review the analog audio performance and possible glitches
  * process for calibrating or verifying each key's response curve?
  * Add ESD protection on the exposed pins
  * Remove the 0 ohm resistors and current measurement shunts
  Workflow for enclosure design:
  * export to DXF
- (in symbol PW/CHRG) G; R
- (in symbol Reverse bicolor LED) R; G
- (in symbol SHIFT) G; R
- (in symbol SSD1306-128x64-OLED-SPI) 128x64 OLED; UG-2864HSWEG01
- (in symbol Strumming_comb_11) Strumming comb

## Library data of the parts
3 5 7 A B C CC D DRUMS E F G INSTR LOOP MINOR SHIFT VOL = CAPACITIVE_PAD: Contributor: ThomasTempe; spicePre: U; spiceSymbolName: CAPACITIVE_PAD
AUDIO2 = PJ-313D_C319112: BOM_Manufacturer: XKB Enterprise; Contributor: LCSC; BOM_Supplier: LCSC; BOM_Supplier Part: C319112; BOM_Manufacturer Part: PJ-313D; spicePre: A
BAT2 = A2001WR-S-2P: BOM_Manufacturer: Changjiang Connectors; Contributor: LCSC; BOM_Supplier: LCSC; BOM_Supplier Part: C225233; BOM_Manufacturer Part: A2001WR-S-2P; spicePre: C
C1 C3 C36-C39 = 1u: BOM_Manufacturer: SAMSUNG; BOM_Manufacturer Part: CL05A105KA5NQNC; BOM_Supplier: LCSC; BOM_Supplier Part: C52923
C2 C79 = 2.2uF: BOM_Manufacturer Part: CL10A225KO8NNNC; BOM_Manufacturer: SAMSUNG; nameAlias: Capacitance; SMT Type: Basic; BOM_Supplier: LCSC; BOM_LCSC Assembly: Yes; BOM_Supplier Part: C23630; spicePre: C; spiceSymbolName: CL10A225KO8NNNC
C4-C6 C8 C9 C13-C15 C18-C21 C23-C28 C47 C65 C66 C70-C78 C84 = 4.7nF: BOM_Manufacturer: FH; BOM_Manufacturer Part: 0402B472K500NT; nameAlias: Capacitance; BOM_Paste Type: base; BOM_Assembly Type: smtWeld; BOM_Supplier: LCSC; BOM_Supplier Part: C1538; spicePre: C; spiceSymbolName: 0402B472K500NT
C7 C10 C31 C33 C35 C40 C43 C44 C46 C49 C52-C55 C57 C58 C60-C62 C64 C83 = 100n: BOM_Manufacturer: SAMSUNG; BOM_Manufacturer Part: CL05B104KO5NNNC; BOM_Supplier: LCSC; BOM_Supplier Part: C1525
C11 C12 = 20pF: BOM_Manufacturer: FH; BOM_Manufacturer Part: 0402CG200J500NT; nameAlias: Capacitance; SMT Type: Basic; BOM_Supplier: LCSC; BOM_LCSC Assembly: Yes; BOM_Supplier Part: C1554; spicePre: C; spiceSymbolName: 0402CG200J500NT
C16 C17 C29 C30 C34 C63 = 1uF: BOM_Manufacturer: SAMSUNG; BOM_Manufacturer Part: CL05A105KA5NQNC; nameAlias: Capacitance; SMT Type: Basic; BOM_Supplier: LCSC; BOM_LCSC Assembly: Yes; BOM_Supplier Part: C52923; spicePre: C; spiceSymbolName: CL05A105KA5NQNC
C22 = 4.7uF: BOM_Manufacturer Part: CL05A475MP5NRNC; BOM_Manufacturer: SAMSUNG; nameAlias: Capacitance; BOM_Paste Type: base; BOM_Supplier: LCSC; BOM_Supplier Part: C23733; spicePre: C; spiceSymbolName: CL05A475MP5NRNC
C32 C45 C56 C59 = 10u: BOM_Manufacturer: SAMSUNG; BOM_Manufacturer Part: CL05A106MQ5NUNC; BOM_Supplier: LCSC; BOM_Supplier Part: C15525
C41 C42 = 100uF: BOM_Manufacturer: Changzhou Huawei Elec; BOM_Manufacturer Part: VT0J101MC054000CE0; nameAlias: Capacitance; Contributor: LCSC; BOM_Supplier: LCSC; BOM_Supplier Part: C271407; spicePre: C; spiceSymbolName: VT0J101MC054000CE0
C48 = 4.7u: BOM_Manufacturer: SAMSUNG; BOM_Manufacturer Part: CL05A475MP5NRNC; BOM_Supplier: LCSC; BOM_Supplier Part: C23733
C50 = 4.7uF: BOM_Manufacturer Part: CL05A475MP5NRNC; BOM_Manufacturer: SAMSUNG; nameAlias: Capacitance; SMT Type: Basic; BOM_Supplier: LCSC; BOM_LCSC Assembly: Yes; BOM_Supplier Part: C23733; spicePre: C; spiceSymbolName: CL05A475MP5NRNC
C51 = 2.2u: BOM_Manufacturer: SAMSUNG; BOM_Manufacturer Part: CL05A225MQ5NSNC; BOM_Supplier: LCSC; BOM_Supplier Part: C23630
C80 C81 = 10pF: BOM_Manufacturer: SAMSUNG; BOM_Manufacturer Part: CL05C100JB5NNNC; nameAlias: Capacitance; SMT Type: Basic; BOM_Supplier: LCSC; BOM_LCSC Assembly: Yes; BOM_Supplier Part: C32949; spicePre: C; spiceSymbolName: CL05C100JB5NNNC
C86 = 100pF: BOM_Manufacturer: FH; BOM_Manufacturer Part: 0402CG101J500NT; nameAlias: Capacitance; BOM_Paste Type: base; BOM_Assembly Type: smtWeld; BOM_Supplier: LCSC; BOM_Supplier Part: C1546; spicePre: C; spiceSymbolName: 0402CG101J500NT
D1 D4 = SS14: BOM_Manufacturer: MDD; SMT Type: Basic; BOM_Supplier: LCSC; BOM_Manufacturer Part: SS14; image: //image.lceda.cn/szlcsc/C2480.jpg; BOM_Supplier Part: C2480; BOM_LCSC Assembly: Yes; spicePre: D; spiceSymbolName: SS14
IC2 = TP4057: BOM_Manufacturer: TOPPOWER; BOM_Supplier: LCSC; BOM_Manufacturer Part: TP4057; BOM_Supplier Part: C12044
L1 = 600Ω: BOM_Manufacturer: Sunlord; BOM_Manufacturer Part: GZ2012D601TF; nameAlias: Value; SMT Type: Basic; BOM_Supplier: LCSC; BOM_LCSC Assembly: Yes; BOM_Supplier Part: C1017; spicePre: L; spiceSymbolName: GZ2012D601TF
LED3 = SHIFT: BOM_Manufacturer: Everlight; BOM_Manufacturer Part: 23-22B/R7G6C-A30/2A; Contributor: ThomasTempe; BOM_Supplier: LCSC; BOM_Supplier Part: C131287; link: http://www.everlight.com/SeriationProduct.aspx?Seq=cc2d52c0-2405-e411-8b3b-0002a54e500f; spicePre: L
LED12 = PW/CHRG: BOM_Manufacturer: Everlight; BOM_Manufacturer Part: 23-22B/R7G6C-A30/2A; Contributor: ThomasTempe; BOM_Supplier: LCSC; BOM_Supplier Part: C131287; link: http://www.everlight.com/SeriationProduct.aspx?Seq=cc2d52c0-2405-e411-8b3b-0002a54e500f; spicePre: L
LED15-LED22 = Reverse bicolor LED: BOM_Manufacturer: Everlight; BOM_Manufacturer Part: 23-22B/R7G6C-A30/2A; Contributor: ThomasTempe; BOM_Supplier: LCSC; BOM_Supplier Part: C131287; link: http://www.everlight.com/SeriationProduct.aspx?Seq=cc2d52c0-2405-e411-8b3b-0002a54e500f; spicePre: L
P1 = BOOT0: BOM_Manufacturer: ReliaPro; BOM_Manufacturer Part: Headers  Pins1x15P 2.54mm; Contributor: snowyang; BOM_Supplier Part: C54102; BOM_Supplier: LCSC; image: http://image.lceda.cn/szlcsc/C54102.jpg; spicePre: P; spiceSymbolName: 2.54 1*2P
P3 = USR: BOM_Manufacturer: ReliaPro; BOM_Manufacturer Part: Headers  Pins1x15P 2.54mm; Contributor: snowyang; BOM_Supplier Part: C54102; BOM_Supplier: LCSC; image: http://image.lceda.cn/szlcsc/C54102.jpg; spicePre: P; spiceSymbolName: 2.54 1*2P
R1 = 1k: BOM_Manufacturer: UniOhm; BOM_Manufacturer Part: 0402WGF1001TCE; BOM_Supplier: LCSC; BOM_Supplier Part: C11702
R2 = 0: BOM_Manufacturer: UniOhm; BOM_Manufacturer Part: 0402WGF0000TCE; nameAlias: Resistance (Ohms); SMT Type: Basic; BOM_Supplier: LCSC; BOM_LCSC Assembly: Yes; BOM_Supplier Part: C17168; spicePre: R; spiceSymbolName: 0402WGF0000TCE
R3 R4 = 200K: BOM_Manufacturer: UniOhm; BOM_Manufacturer Part: 0402WGF2003TCE; nameAlias: Resistance (Ohms); BOM_Paste Type: base; BOM_Assembly Type: smtWeld; BOM_Supplier: LCSC; BOM_Supplier Part: C25764; spicePre: R; spiceSymbolName: 0402WGF2003TCE
R5 R7 = 5.1K: BOM_Manufacturer: UniOhm; BOM_Manufacturer Part: 0402WGF5101TCE; nameAlias: Resistance (Ohms); SMT Type: Basic; BOM_Supplier: LCSC; BOM_Supplier Part: C25905; BOM_JLCPCB SMD: Yes; spicePre: R; spiceSymbolName: 0402WGF5101TCE
R6 R15 R19-R22 R34 R36 = 4.7K: BOM_Manufacturer: UniOhm; BOM_Manufacturer Part: 0402WGF4701TCE; nameAlias: Resistance (Ohms); SMT Type: Basic; BOM_Supplier: LCSC; BOM_LCSC Assembly: Yes; BOM_Supplier Part: C25900; spicePre: R; spiceSymbolName: 0402WGF4701TCE
R8 R18 R37 = 100K: BOM_Manufacturer: UniOhm; BOM_Manufacturer Part: 0402WGF1003TCE; nameAlias: Resistance (Ohms); SMT Type: Basic; BOM_Supplier: LCSC; BOM_LCSC Assembly: Yes; BOM_Supplier Part: C25741; spicePre: R; spiceSymbolName: 0402WGF1003TCE
R9 = 510: BOM_Manufacturer: UniOhm; BOM_Manufacturer Part: 0402WGF5100TCE; nameAlias: Resistance (Ohms); BOM_Paste Type: base; BOM_Supplier: LCSC; BOM_Supplier Part: C25123; spicePre: R; spiceSymbolName: 0402WGF5100TCE
R10-R13 R23 R35 R53 R54 = 47k: BOM_Manufacturer: UniOhm; BOM_Manufacturer Part: 0402WGF4702TCE; BOM_Supplier: LCSC; BOM_Supplier Part: C25792
R31 = 10K: BOM_Manufacturer: UniOhm; BOM_Manufacturer Part: 0402WGF1002TCE; nameAlias: Resistance (Ohms); SMT Type: Basic; BOM_Supplier: LCSC; BOM_LCSC Assembly: Yes; BOM_Supplier Part: C25744; spicePre: R; spiceSymbolName: 0402WGF1002TCE
R47 R48 = 1: BOM_Manufacturer: UniOhm; BOM_Manufacturer Part: 0402WGF100KTCE; BOM_Supplier: LCSC; BOM_Supplier Part: C25086
R52 = 10k: BOM_Manufacturer: UniOhm; BOM_Manufacturer Part: 0402WGF1002TCE; BOM_Supplier: LCSC; BOM_Supplier Part: C25744
R56 R64-R66 R69 R72 R73 R76 R78-R86 = 220: BOM_Manufacturer: UniOhm; BOM_Manufacturer Part: 0402WGF2200TCE; BOM_Supplier: LCSC; BOM_Supplier Part: C25091
R57 = 2k: BOM_Manufacturer: UniOhm; BOM_Manufacturer Part: 0402WGF2001TCE; BOM_Supplier: LCSC; BOM_Supplier Part: C4109
RN1 = 1K: BOM_Manufacturer: UniOhm; BOM_Manufacturer Part: 4D02WGJ0102TCE; nameAlias: Resistance (Ohms); BOM_Paste Type: base; BOM_Assembly Type: smtWeld; BOM_Supplier: LCSC; BOM_Supplier Part: C25726; spicePre: R; spiceSymbolName: 4D02WGJ0102TCE
RN2-RN7 = 10k: BOM_Manufacturer: UniOhm; BOM_Manufacturer Part: 4D02WGJ0103TCE; nameAlias: Resistance (Ohms); BOM_Paste Type: expand; BOM_Assembly Type: smtWeld; BOM_Supplier: LCSC; BOM_Supplier Part: C25725; spicePre: R; spiceSymbolName: 4D02WGJ0472TCE
SR3 SR4 = 74HC595A: BOM_Manufacturer: Nexperia; BOM_Manufacturer Part: 74HC595D,118; BOM_Supplier: LCSC; BOM_Supplier Part: C5947; spicePre: U
SSD1306 = SSD1306-128x64-OLED-SPI: sourceId: wICUcuL3l; spicePre: X; timeStamp: 1456014235; BOM_Manufacturer Part: ?
SW1 = TS-1187A-B-A-B: BOM_Manufacturer: XKB Enterprise; Contributor: LCSC; BOM_Paste Type: recommend; BOM_Supplier: LCSC; BOM_Supplier Part: C318884; BOM_Manufacturer Part: TS-1187A-B-A-B; spicePre: S; spiceSymbolName: TS-1187A-B-A-B
SW2 = SK-12D02-VG3: BOM_Manufacturer: Rectangular Connectors - Contacts; Contributor: LCSC; BOM_Supplier: LCSC; BOM_Supplier Part: C136723; BOM_Manufacturer Part: SK-12D02-VG3; spicePre: S; spiceSymbolName: SK-12D02-VG3
TV1 = SRV05-4-P-T7: BOM_Manufacturer: PROTEK; SMT Type: Basic; BOM_Supplier: LCSC; BOM_Manufacturer Part: SRV05-4-P-T7; BOM_LCSC Assembly: Yes; image: //image.lceda.cn/szlcsc/C85364.jpg; BOM_Supplier Part: C85364; spicePre: T; spiceSymbolName: SRV05-4-P-T7
U1 = XW06A: BOM_Manufacturer: Sam&wing; Contributor: LCSC; BOM_Paste Type: expand; BOM_Assembly Type: smtWeld; BOM_Supplier: LCSC; BOM_Supplier Part: C389301; BOM_Manufacturer Part: XW06A; spicePre: U; spiceSymbolName: XW06A
U2 = W25Q128JVSIQTR: BOM_Manufacturer: WINBOND; SMT Type: Basic; BOM_Supplier: LCSC; BOM_Manufacturer Part: W25Q128JVSIQTR; BOM_Supplier Part: C97521; BOM_LCSC Assembly: Yes; spicePre: U; spiceSymbolName: W25Q128JVSIQTR
U3 U4 U28 U30 = XC6206P332MR: BOM_Manufacturer: TOREX; SMT Type: Basic; BOM_Supplier: LCSC; BOM_Manufacturer Part: XC6206P332MR; BOM_LCSC Assembly: Yes; image: //image.lceda.cn/szlcsc/C5446.jpg; BOM_Supplier Part: C5446; spicePre: U; spiceSymbolName: XC6206P332MR
U5 = Strumming_comb_11: Contributor: ThomasTempe; spicePre: U; spiceSymbolName: Strumming_comb_11
U20#1 U20#2 = STM32F405RGT6: BOM_Manufacturer: ST; subpart_no: 1; tags: STM32; BOM_Supplier Part: C15742; BOM_Supplier: LCSC; BOM_Manufacturer Part: STM32F405RGT6; image: http://image.lceda.cn/szlcsc/C15742.jpg; spicePre: U; spiceSymbolName: STM32F405RGT6
UC1-UC3 = AT42QT1110-AUR: BOM_Manufacturer: Microchip Tech; Contributor: LCSC; SMT Type: Extend; BOM_Supplier: LCSC; BOM_Supplier Part: C219838; BOM_Manufacturer Part: AT42QT1110-AUR; BOM_LCSC Assembly: Yes; spicePre: U; spiceSymbolName: AT42QT1110-AUR
USBC1 = TYPE-C-31-M-12: BOM_Manufacturer: Rectangular Connectors - Contacts; Contributor: LCSC; BOM_Supplier: LCSC; BOM_Supplier Part: C165948; BOM_Manufacturer Part: TYPE-C-31-M-12; spicePre: U; spiceSymbolName: TYPE-C-31-M-12
VOLUME = Slide Key 4 pads: BOM_Manufacturer: Generic Components; Contributor: ThomasTempe; spicePre: ?; spiceSymbolName: Slide Key 4 pads
X1 X3 = 12MHz: BOM_Manufacturer: YXC; BOM_Manufacturer Part: X322512MSB4SI; nameAlias: Frequency; SMT Type: Basic; BOM_Supplier: LCSC; BOM_LCSC Assembly: Yes; BOM_Supplier Part: C9002; spicePre: X; spiceSymbolName: X322512MSB4SI